# Altium schematic sheet LAN9252-1.SchDoc
size B
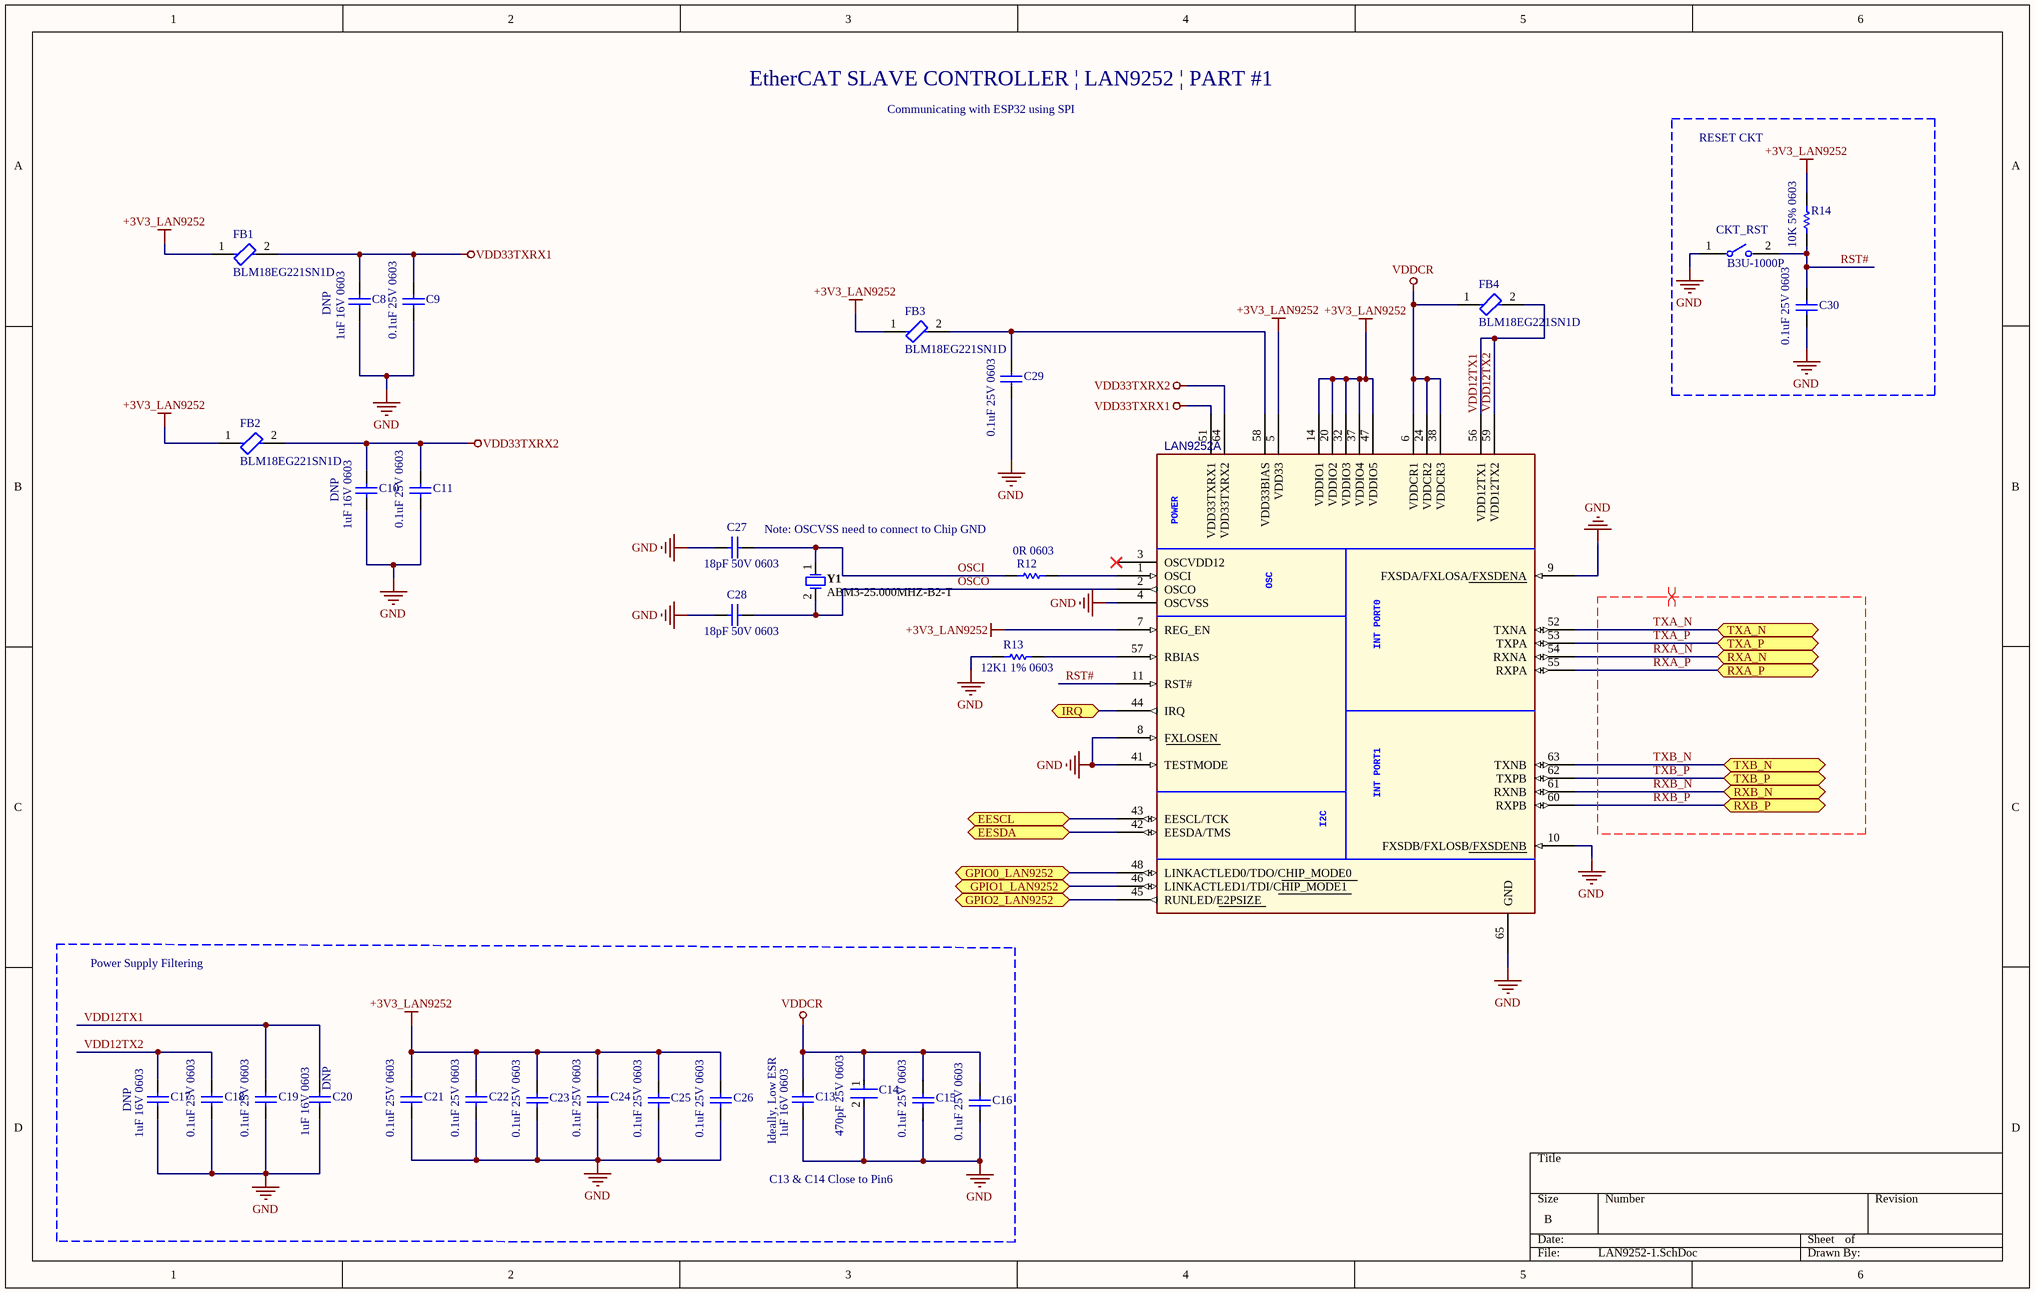
[diagram p0: LAN9252-1.SchDoc]

## Parts
C8  1uF 16V 0603  [CAPC1608X90X35LL15T15]
C9  0.1uF 25V 0603  [CAPC1608X90X35LL10T15]
C10  1uF 16V 0603  [CAPC1608X90X35LL15T15]
C11  0.1uF 25V 0603  [CAPC1608X90X35LL10T15]
C13  1uF 16V 0603  [CAPC1608X90X35LL15T15]
C14  470pF 25V 0603  [FP-C0603C-CF-MFG]
C15  0.1uF 25V 0603  [CAPC1608X90X35LL10T15]
C16  0.1uF 25V 0603  [CAPC1608X90X35LL10T15]
C17  1uF 16V 0603  [CAPC1608X90X35LL15T15]
C18  0.1uF 25V 0603  [CAPC1608X90X35LL10T15]
C19  0.1uF 25V 0603  [CAPC1608X90X35LL10T15]
C20  1uF 16V 0603  [CAPC1608X90X35LL15T15]
C21  0.1uF 25V 0603  [CAPC1608X90X35LL10T15]
C22  0.1uF 25V 0603  [CAPC1608X90X35LL10T15]
C23  0.1uF 25V 0603  [CAPC1608X90X35LL10T15]
C24  0.1uF 25V 0603  [CAPC1608X90X35LL10T15]
C25  0.1uF 25V 0603  [CAPC1608X90X35LL10T15]
C26  0.1uF 25V 0603  [CAPC1608X90X35LL10T15]
C27  18pF 50V 0603  [CAPC1608X90X40LL10T20]
C28  18pF 50V 0603  [CAPC1608X90X40LL10T20]
C29  0.1uF 25V 0603  [CAPC1608X90X35LL10T15]
C30  0.1uF 25V 0603  [CAPC1608X90X35LL10T15]
CKT_RST  B3U-1000P  [FP-B3U-1000P-MFG]
FB1  BLM18EG221SN1D  [FP-BLM18-0_15-t0_8-MFG]
FB2  BLM18EG221SN1D  [FP-BLM18-0_15-t0_8-MFG]
FB3  BLM18EG221SN1D  [FP-BLM18-0_15-t0_8-MFG]
FB4  BLM18EG221SN1D  [FP-BLM18-0_15-t0_8-MFG]
LAN9252  (no value)  [LAN9252_QFN]  (part A of 2)
R12  0R 0603  [RESC1608X55X25ML10T15]
R13  12K1 1% 0603  [RESC0603X28X15ML05T05]
R14  10K 5% 0603  [RESC1608X55X25ML10T15]
Y1  ABM3-25.000MHZ-B2-T  [ABRA-ABM3_V]

## Blocks framed on the sheet
RESET CKT: C30 CKT_RST R14

## Ports
EESCL (bidir), EESDA (bidir), GPIO0_LAN9252 (bidir), GPIO1_LAN9252 (bidir), GPIO2_LAN9252 (bidir), IRQ (bidir), RXA_N (bidir), RXA_P (bidir), RXB_N (bidir), RXB_P (bidir), TXA_N (bidir), TXA_P (bidir), TXB_N (bidir), TXB_P (bidir)

## Nets
+3V3_LAN9252: C21.2 C22.2 C23.2 C24.2 C25.2 C26.2 FB1.1 FB2.1 FB3.1 LAN9252.5(VDD33) LAN9252.7(REG_EN) LAN9252.14(VDDIO1) LAN9252.20(VDDIO2) LAN9252.32(VDDIO3) LAN9252.37(VDDIO4) LAN9252.47(VDDIO5) R14.2
GND: C8.1 C9.1 C10.1 C11.1 C13.1 C14.2 C15.1 C16.1 C17.1 C18.1 C19.1 C20.1 C21.1 C22.1 C23.1 C24.1 C25.1 C26.1 C27.1 C28.1 C29.1 C30.1 CKT_RST.1 LAN9252.4(OSCVSS) LAN9252.8(FXLOSEN) LAN9252.9(FXSDA/FXLOSA/FXSDENA) LAN9252.10(FXSDB/FXLOSB/FXSDENB) LAN9252.41(TESTMODE) LAN9252.65(GND) R13.1
VDD33TXRX1: C8.2 C9.2 FB1.2 LAN9252.51(VDD33TXRX1)
VDD33TXRX2: C10.2 C11.2 FB2.2 LAN9252.64(VDD33TXRX2)
VDDCR: C13.2 C14.1 C15.2 C16.2 FB4.1 LAN9252.6(VDDCR1) LAN9252.24(VDDCR2) LAN9252.38(VDDCR3)
EESCL: LAN9252.43(EESCL/TCK) ; port EESCL
EESDA: LAN9252.42(EESDA/TMS) ; port EESDA
GPIO0_LAN9252: LAN9252.48(LINKACTLED0/TDO/CHIP_MODE0) ; port GPIO0_LAN9252
GPIO1_LAN9252: LAN9252.46(LINKACTLED1/TDI/CHIP_MODE1) ; port GPIO1_LAN9252
GPIO2_LAN9252: LAN9252.45(RUNLED/E2PSIZE) ; port GPIO2_LAN9252
IRQ: LAN9252.44(IRQ) ; port IRQ
OSCI: C27.2 R12.1 Y1.1
OSCO: C28.2 LAN9252.2(OSCO) Y1.2
RST#: C30.2 CKT_RST.2 LAN9252.11(RST#) R14.1
RXA_N: LAN9252.54(RXNA) ; port RXA_N
RXA_P: LAN9252.55(RXPA) ; port RXA_P
RXB_N: LAN9252.61(RXNB) ; port RXB_N
RXB_P: LAN9252.60(RXPB) ; port RXB_P
TXA_N: LAN9252.52(TXNA) ; port TXA_N
TXA_P: LAN9252.53(TXPA) ; port TXA_P
TXB_N: LAN9252.63(TXNB) ; port TXB_N
TXB_P: LAN9252.62(TXPB) ; port TXB_P
VDD12TX1: C17.2 C18.2 C19.2 C20.2 FB4.2 LAN9252.56(VDD12TX1) LAN9252.59(VDD12TX2)  [also labelled VDD12TX2]
NetC29_2: C29.2 FB3.2 LAN9252.58(VDD33BIAS)
NetLAN9252_1: LAN9252.1(OSCI) R12.2
NetLAN9252_57: LAN9252.57(RBIAS) R13.2

Not connected (* = marked no-connect by the designer): LAN9252 3(OSCVDD12)*

## Layout directives
differential pair; differential pair class ETHERNET; rule Differential Pairs Routing [Pref Gap = 0.254mm    Min Gap  = 0.254mm    Max Gap  = 0.254mmPref Width = 0.381mm    Min Width  = 0.127mm    Max Width  = 0.381mm]: RXA_N, RXA_P, RXB_N, RXB_P, TXA_N, TXA_P, TXB_N, TXB_P

## Notes on the sheet
- EtherCAT SLAVE CONTROLLER | LAN9252 | PART #1
- Communicating with ESP32 using SPI
- (near C8) DNP
- (near C10) DNP
- Note: OSCVSS need to connect to Chip GND
- Power Supply Filtering
- (near C17) DNP
- (near C20) DNP
- (near C13) Ideally, Low ESR
- C13 & C14 Close to Pin6
- (in symbol LAN9252_QFN64, part A) POWER; OSC; INT PORT0; INT PORT1; I2C

## Library data of the parts
C8 C10 C13 C17 C20 = CMP-2006-02298-2: Manufacturer: Kemet; Part Number: C0603C105K4RACTU
C9 C11 C15 C16 C18 C19 C21-C26 C29 C30 = CMP-2006-02868-1: Part Number: GRM188R71E104KA01D; Manufacturer: Murata
C14 = CMP-1035-01671-3: CAP CER 470PF 25V 10% X7R 0603; Manufacturer: KEMET; Manufacturer Part Number: C0603C471K3RACTU; Tolerance: 0.1; Automotive Grade: Grade 1; Material: Ceramic; Temperature Coefficient: 30ppm/°C; Category: Cap; Device Class L2: Capacitors; ComponentLink2URL: https://api.kemet.com/component-edge/download/datasheet/C0603C100J5GACAUTO.pdf; Voltage Rating: 25 V; RoHS: TRUE; Value: 470 pF; Automotive: Yes; Capacitance: 470 pF; Temperature Characteristic: X7R; Height: 0.87mm; Lead Free: Yes; Temperature: -55°C to +125°C; Temperature Range High: +125°C; Package: C0603C-CF; Digikey Description: CAP CER 470PF 25V 10% X7R 0603; Mouser Description: Multilayer Ceramic Capacitors MLCC - SMD/SMT 25volts 470pF X7R 10%; Device Class L1: Passive Components; ComponentLink2Description: Datasheet; Device Class L3: Ceramic Capacitors; Temperature Range Low: -55°C; Octopart: https://octopart.com/c0603c471k3ractu-kemet-9143746
C27 C28 = CMP-1659-00030-1: Chip Capacitor, 18 pF, +/- 5%, 50 V, -55 to 125 degC, 0603 (1608 Metric), RoHS, Tape and Reel; Case\Package: 0603; Power Rating: 100 mW; Resistance: 68.1 Ohm; Tolerance: 1%; Case Code (Metric): 1608; Max Operating Temperature: 155 degC; RoHSCompliant: true; Case Code (Imperial): 0603; Voltage Rating: 50 V; ComponentLink2Description: Datasheet; Package Quantity: 200; PackageReference: 0603; ComponentLink2URL: http://www.yageo.com/NewPortal/yageodocoutput?fileName=/pdf/MLCC/UPY-GP_NP0_16V-to-50V_14.pdf; Length: 1.6 mm; DatasheetVersion: Rev. 14, 07/2016; Min Operating Temperature: -55 degC; ComponentLink1URL: http://www.yageo.com/; Width: 0.8 mm; ComponentLink1Description: Manufacturer URL; Height: 0.45 mm; Radiation Hardening: No; PackageDescription: 2-Pin Surface Mount Device, Body 1.6 x 0.8 mm; Packaging: Tape and Reel
CKT_RST = CMP-2100-03586-2: SWITCH TACTILE SPST-NO 0.05A 12V; Contact Resistance: 100mR; Operating Force: 1.5N; Max Current Rating: 50mA; Switch Travel: 0.15mm; Actuator Type: Standard; Mechanical Life: 200000Cycles; Ratings: Dust Proof; Illumination Type: Non-Illuminated; Throw Configuration: SPST; Actuator Length: 0.4mm; Switch Function: Off-Mom; Height: 1.2mm; Width: 3mm; Weight: 0.000776oz; Contact Material: Silver; Max Voltage Rating (DC): 12V; Insulation Resistance: 100MR; Lead Free: Lead Free; Current Rating: 50mA; Termination: SMD/SMT; Length: 4mm; Voltage Rating (DC): 12V; Contact Current Rating: 50mA; Orientation: Straight; Depth: 2.5mm; Max Operating Temperature: 70°C; Packaging: Tape and Reel; Min Operating Temperature: -25°C; Package Quantity: 1; Mount: Surface Mount; Electrical Life: 200000Cycles
FB1-FB4 = CMP-0686-00360-3: Chip Ferrite Bead, 0603, 220Ω @ 100MHz, 0.05Ω, 25%, 2A; Impedance: 220R; Number of Lines: 1; Material: Steel; Resistance: 50mR; Core Material: Ferrite; Test Frequency: 100MHz; Contact Plating: Tin; Case Code (Imperial): 0603; DC Current: 2A; Lead Free: Lead Free; Frequency: 100MHz; Max Current Rating: 2A; Depth: 0.8mm; Width: 0.8mm; Number of Pins: 2; Min Operating Temperature: -55°C; Package Quantity: 1; Tolerance: 25%; Max Operating Temperature: 125°C; Height: 0.8mm; Military Standard: Not; Termination: SMD/SMT; REACH SVHC: No SVHC; Max DC Current: 2A; Radiation Hardening: No; Case Code (Metric): 1608; Current Rating: 2A; Number of Circuits: 1; Length: 1.6mm; Case/Package: 0603; Packaging: Tape and Reel; DC Resistance (DCR): 50mR
LAN9252 = LAN9252_QFN64: IC, 2/3-Port EtherCAT® Slave Controller, QFN64; Manufacturer Part Number 1: LAN9252x/ML; Manufacturer 1: Microchip; Populated: Yes; Owner: Manikandan; Supplier Part Number 1: LAN9252I/ML-ND; Supplier 1: Digikey; Description_: IC, 2/3-Port EtherCAT® Slave Controller, QFN64; RoHS: Yes; Package: QFN64-9X9x1; Document Link: http://ww1.microchip.com/downloads/en/DeviceDoc/00001909A.pdf; Status: New
R12 = CMP-2100-03667-1: Chip Resistor, 0 Ohm, +/- 5%, 0.1 W, -55 to 155 degC, 0603 (1608 Metric), RoHS, Tape and Reel; Manufacturer: Yageo; Temperature Coefficient: 200ppm/degreesC; Voltage Rating: 50V; Power Rating: 100mW; Resistance: 0mOhm; Width: 0.8mm; Max Operating Temperature: 155degC; Tolerance: 5%; Package Reference: 0603; Height: 0.45mm; Depth: 0.8mm; Package Description: 2-Pin Surface Mount Device, Body 1.6 x 0.8 mm; Termination: SMD/SMT; Package Quantity: 5000; Case/Package: 0603; Case Code (Imperial): 0603; Radiation Hardening: No; Number of Pins: 2; Length: 1.6mm; Lead Free: LeadFree; Voltage Rating (DC): 50V; Military Standard: Not; Datasheet URL: http://www.yageo.com/NewPortal/yageodocoutput?fileName=/pdf/R-Chip/PYu-RC_Group_51_RoHS_L_5.pdf; Manufacturer URL: http://www.yageo.com/; Packaging: TapeandReel; Case Code (Metric): 1608; Min Operating Temperature: -55degC; Composition: ThickFilm; RoHSCompliant: true; Contact Plating: Tin; Datasheet Version: Rev. 5, 10/2016; REACH SVHC: NoSVHC
R13 = CMP-2004-00071-1: Part Number: CRCW020112K1FNED; Manufacturer: Vishay Dale
R14 = CMP-2100-03664-1: Chip Resistor, 10 KOhm, +/- 1%, 01 W, -55 to 155 degC, 0603 (1608 Metric), RoHS, Tape and Reel; Manufacturer: Yageo; Temperature Coefficient: 100ppm/degreesC; Resistance: 10KOhm; Voltage Rating: 75V; Power Rating: 100mW; Voltage Rating (DC): 50V; Composition: ThickFilm; RoHSCompliant: true; Height: 0.45mm; Lead Free: LeadFree; Case Code (Metric): 1608; Case/Package: 0603; Datasheet Version: Rev. 5, 10/2016; Package Reference: 0603; Depth: 0.8mm; Package Description: 2-Pin Surface Mount Device, Body 1.6 x 0.8 mm; Case Code (Imperial): 0603; Packaging: TapeandReel; Termination: SMD/SMT; Lead Pitch: 0.3mm; Width: 0.8mm; Number of Pins: 2; Length: 1.6mm; REACH SVHC: NoSVHC; Military Standard: Not; Max Operating Temperature: 155degC; Min Operating Temperature: -55degC; Manufacturer URL: http://www.yageo.com/; Datasheet URL: http://www.yageo.com/NewPortal/yageodocoutput?fileName=/pdf/R-Chip/PYu-RC_Group_51_RoHS_L_5.pdf; Weight: 7.1E-05oz; Tolerance: 1%
Y1 = CMP-2000-05729-1: Miniature Ceramic Crystal, 25 MHz, +/- 20 ppm, -20 to 70 degC, 2-Pin SMD, RoHS, Tape and Reel; Manufacturer: ABRACON; Case Height: 1.3mm; Tolerance: 20PPM; Load Capacitance: 18pF; Frequency: 25MHz; ESR: 30Ohms; Frequency Stability: 50PPM; Case Width: 3.2mm; Case Length: 5mm; Packaging: Reel; Package Description: 2-Pin Surface Mount Device, Body 5 x 3.2 mm; Manufacturer URL: http://www.abracon.com/; Mounting Technology: SurfaceMount; RoHS: Details; Operating Temperature Range: -20Cto+70C; Datasheet URL: http://www.abracon.com/Resonators/abm3.pdf; Type: MiniatureCeramicCrystal; Series: ABM3; Product Category: Crystals; Factory Pack Quantity: 1000; Mounting Style: SMD/SMT; Brand: ABRACON; Datasheet Version: 09/2013; Dimensions: 3.2mmWx5mmLx1.3mmH; Termination Style: SMD/SMT; Package Reference: ABM3; Package / Case: 5mmx3.2mm